# Altium schematic sheet OVERVIEW.SchDoc
size A4; SheetNumber: 1; SheetTotal: 6
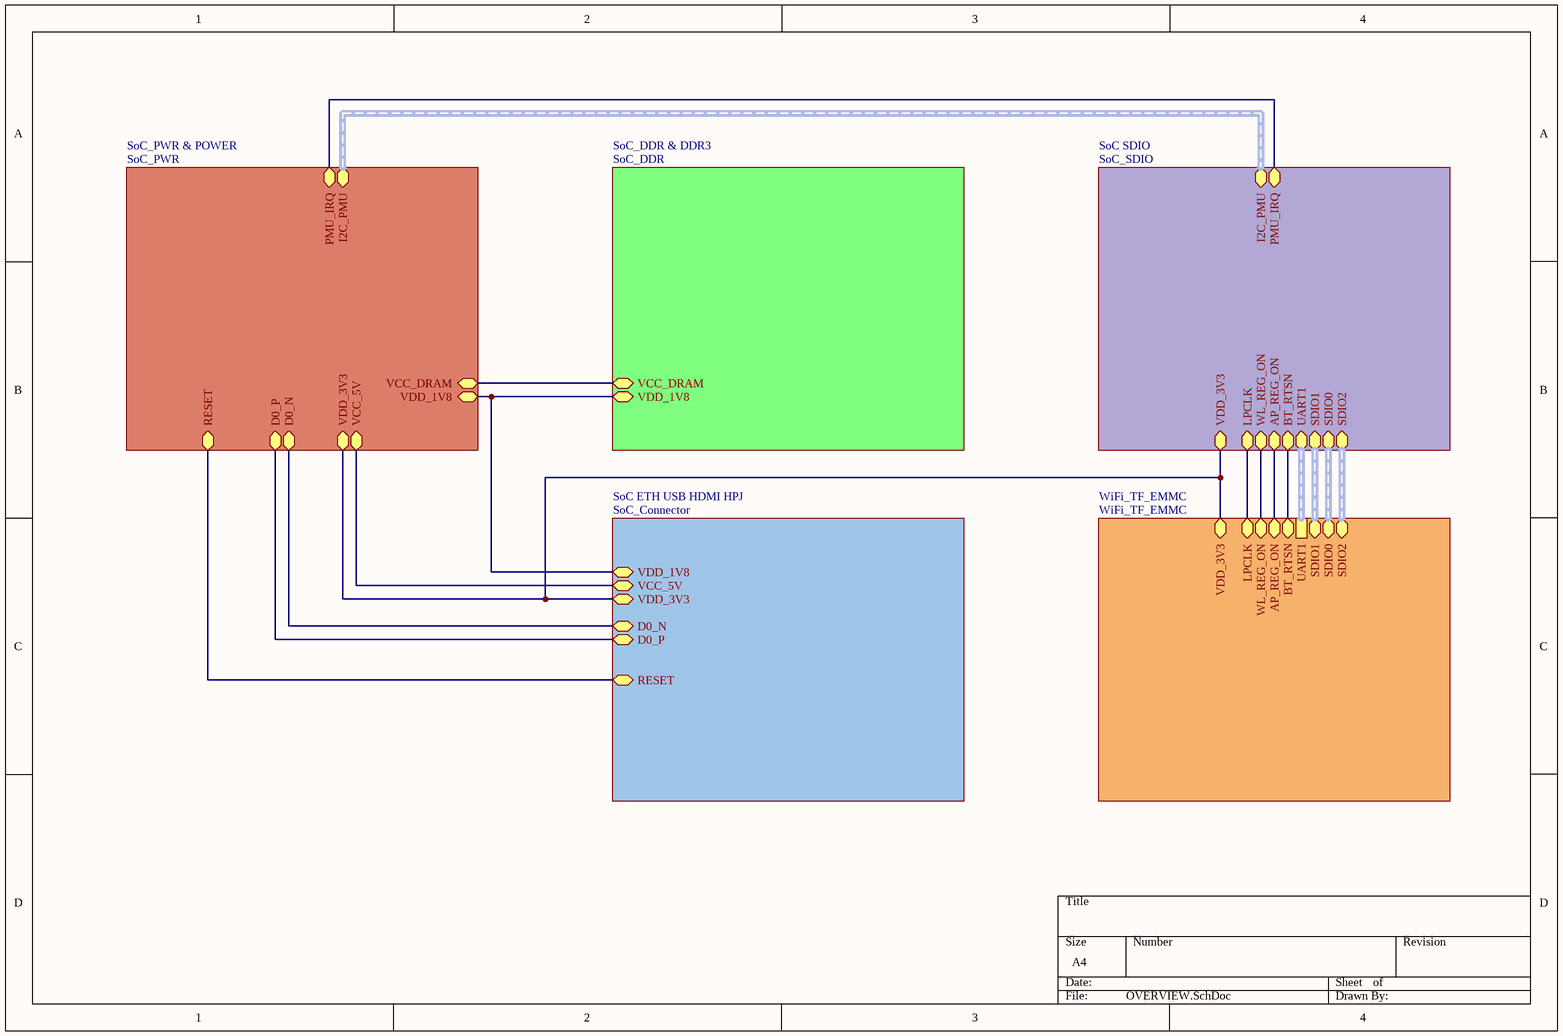
[diagram p0: OVERVIEW.SchDoc]

## Sub-sheets
SoC ETH USB HDMI HPJ = SoC_Connector: VCC_5V (bidir), VDD_3V3 (bidir), VDD_1V8 (bidir), D0_N (bidir), D0_P (bidir), RESET (bidir)
SoC SDIO = SoC_SDIO: VDD_3V3 (bidir), LPCLK (bidir), WL_REG_ON (bidir), AP_REG_ON (bidir), BT_RTSN (bidir), UART1 (bidir), SDIO1 (bidir), SDIO0 (bidir), I2C_PMU (bidir), PMU_IRQ (bidir), SDIO2 (bidir)
SoC_DDR & DDR3 = SoC_DDR: VCC_DRAM (bidir), VDD_1V8 (bidir)
SoC_PWR & POWER = SoC_PWR: VCC_DRAM (bidir), VDD_1V8 (bidir), VCC_5V (bidir), VDD_3V3 (bidir), D0_P (bidir), D0_N (bidir), I2C_PMU (bidir), RESET (bidir), PMU_IRQ (bidir)
WiFi_TF_EMMC = WiFi_TF_EMMC: LPCLK (bidir), WL_REG_ON (bidir), AP_REG_ON (bidir), BT_RTSN (bidir), UART1, SDIO1 (bidir), VDD_3V3 (bidir), SDIO0 (bidir), SDIO2 (bidir)

## Nets
(unnamed): sheet SoC_DDR & DDR3/VCC_DRAM, sheet SoC_PWR & POWER/VCC_DRAM
(unnamed): sheet SoC_DDR & DDR3/VDD_1V8, sheet SoC_PWR & POWER/VDD_1V8, sheet SoC ETH USB HDMI HPJ/VDD_1V8
(unnamed): sheet SoC_PWR & POWER/VCC_5V, sheet SoC ETH USB HDMI HPJ/VCC_5V
(unnamed): sheet SoC_PWR & POWER/VDD_3V3, sheet SoC ETH USB HDMI HPJ/VDD_3V3, sheet SoC SDIO/VDD_3V3, sheet WiFi_TF_EMMC/VDD_3V3
(unnamed): sheet SoC_PWR & POWER/D0_P, sheet SoC ETH USB HDMI HPJ/D0_P
(unnamed): sheet SoC_PWR & POWER/D0_N, sheet SoC ETH USB HDMI HPJ/D0_N
(unnamed): sheet SoC_PWR & POWER/RESET, sheet SoC ETH USB HDMI HPJ/RESET
(unnamed): sheet SoC_PWR & POWER/PMU_IRQ, sheet SoC SDIO/PMU_IRQ
(unnamed): sheet SoC SDIO/LPCLK, sheet WiFi_TF_EMMC/LPCLK
(unnamed): sheet SoC SDIO/WL_REG_ON, sheet WiFi_TF_EMMC/WL_REG_ON
(unnamed): sheet SoC SDIO/AP_REG_ON, sheet WiFi_TF_EMMC/AP_REG_ON
(unnamed): sheet SoC SDIO/BT_RTSN, sheet WiFi_TF_EMMC/BT_RTSN

## Buses and harness runs
harness sheet SoC SDIO/I2C_PMU = sheet SoC_PWR & POWER/I2C_PMU
harness sheet SoC SDIO/SDIO0 = sheet WiFi_TF_EMMC/SDIO0
harness sheet SoC SDIO/SDIO1 = sheet WiFi_TF_EMMC/SDIO1
harness sheet SoC SDIO/SDIO2 = sheet WiFi_TF_EMMC/SDIO2
harness sheet SoC SDIO/UART1 = sheet WiFi_TF_EMMC/UART1